# EAGLE design GAGAN_container_V1 (EAGLE 9.3.2)
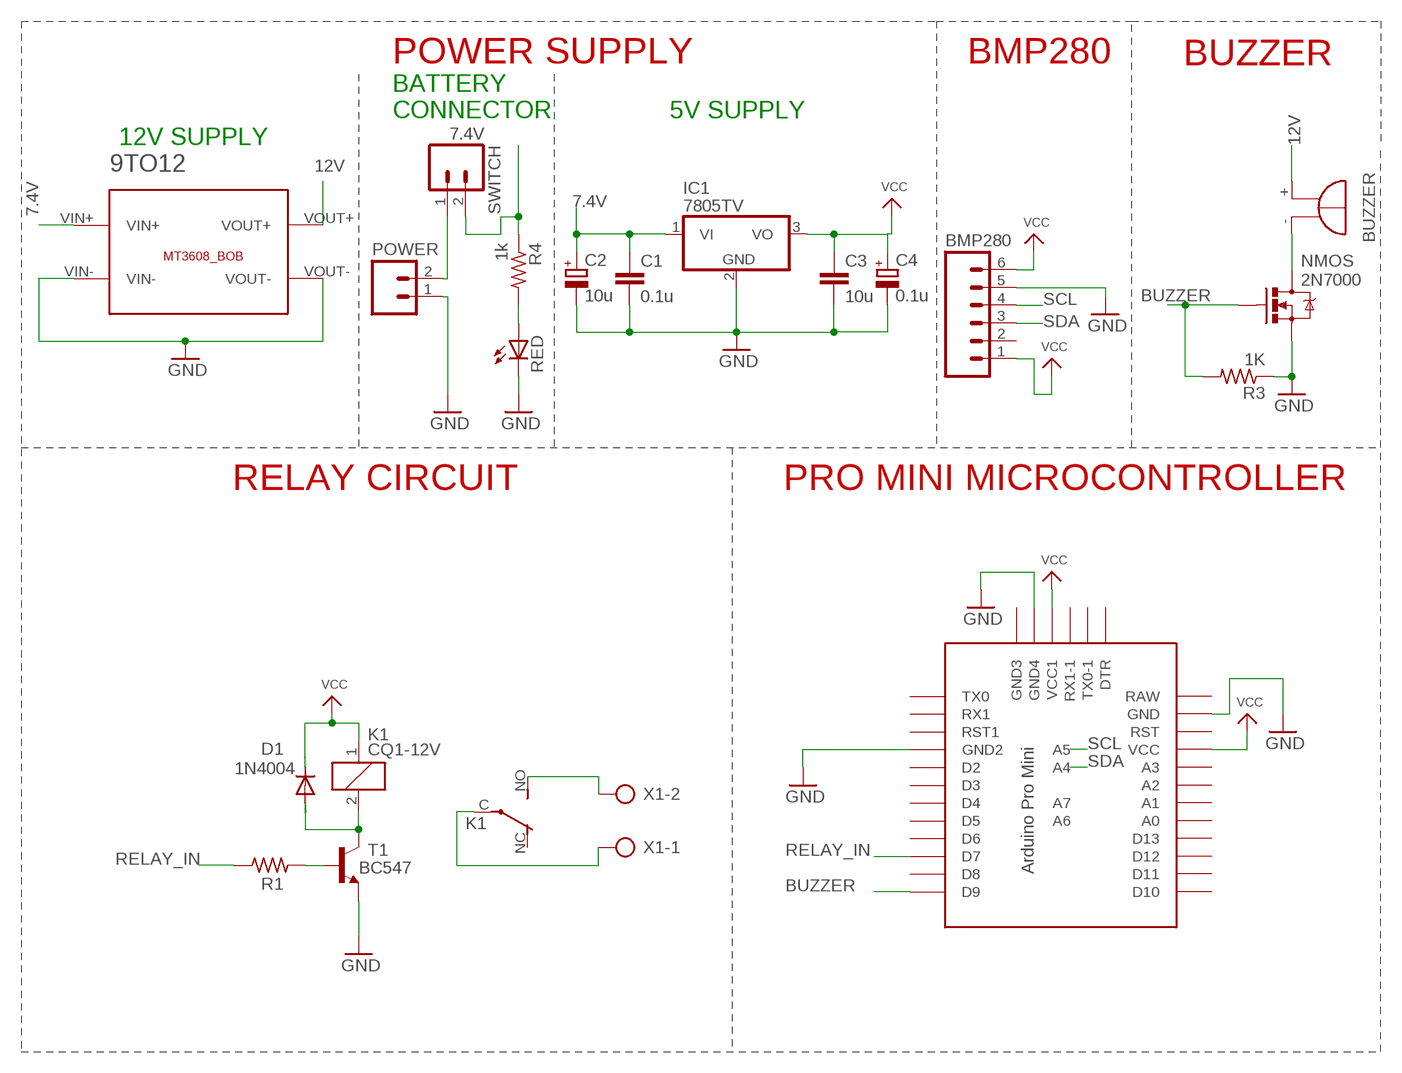
[diagram p0: schematic, sheet 1]

## Parts
9TO12  BREAKOUTS_MT3608_BOB  [BREAKOUTS_MT3608_BOB]
BMP280  M06  [06P]
C1  0.1u  C-EU025-025X050  [C025-025X050]
C2  10u  CPOL-EUE2.5-6  [E2,5-6]
C3  10u  C-EU025-025X050  [C025-025X050]
C4  0.1u  CPOL-EUE2.5-6  [E2,5-6]
D1  1N4004  [DO41-10]
IC1  7805TV  [TO220V]
K1  CQ1-12V  [CQ1]
POWER  CEDT_JANUARY_2015_V5_M02  [CEDT_JANUARY_2015_V5_02P]
Q1  SPARKFUN-DISCRETESEMI_MOSFET-NCHANNEL2N7000  [SPARKFUN-DISCRETESEMI_TO-92]
R1  R-US_0207/7  [0207/7]
R3  1K  R-US_0204/7  [0204/7]
R4  1k  R-US_0204/7  [0204/7]
RED  red  LED3MM  [LED3MM]
SG1  BUZZER_EB2209A  [BUZZER_EB2209A]
SWITCH  M02  [02P]
T1  BC547  [TO92]
U$1  PRO-MINI-2  [PRO-MINI-2]
X1  AK500/2-H  [AK500/2-H]

## Nets
7.4V [power]: 9TO12.VIN+ C1.1 C2.+ IC1.1(VI) R4.1 SWITCH.2
12V [power]: 9TO12.VOUT+ SG1.+
BUZZER: Q1.2(G) R3.2 U$1.D9
GND: 9TO12.VIN- 9TO12.VOUT- BMP280.5 C1.2 C2.- C3.2 C4.- IC1.2(GND) POWER.1 Q1.1(S) R3.1 RED.K(C) T1.1(E) U$1.GND U$1.GND1(GND2) U$1.GND3(GND4)
N$1 [power]: POWER.2 SWITCH.1
N$2: R4.2 RED.A
N$3 [power]: Q1.3(D) SG1.-
N$10: D1.A K1.2 T1.3(C)
N$11: R1.2 T1.2(B)
N$12: K1.C(2:P) X1.1
N$13: K1.NO(2:S) X1.2
RELAY_IN: R1.1 U$1.D7
SCL: BMP280.4 U$1.A5
SDA: BMP280.3 U$1.A4
VCC: BMP280.1 BMP280.6 C3.1 C4.+ D1.C IC1.3(VO) K1.1 U$1.VCC U$1.VCC1
Unconnected: BMP280.2 K1.NC(2:O) U$1.A0 U$1.A1 U$1.A2 U$1.A3 U$1.A6 U$1.A7 U$1.D2 U$1.D3 U$1.D4 U$1.D5 U$1.D6 U$1.D8 U$1.D10 U$1.D11 U$1.D12 U$1.D13 U$1.DTR U$1.GND2(GND3) U$1.RAW U$1.RST U$1.RST1 U$1.RX1 U$1.RX1-1 U$1.TX0 U$1.TX0-1

## Notes on the sheet
- POWER SUPPLY | BMP280 | BUZZER
- BATTERY
  CONNECTOR
- 5V SUPPLY
- 12V SUPPLY
- RELAY CIRCUIT | PRO MINI MICROCONTROLLER

## Library data of the parts
9TO12 = Cansat2019_3279_Container_v01:BREAKOUTS_MT3608_BOB
BMP280 = con-amp-quick:M06: AMP QUICK CONNECTOR; OC_FARNELL: unknown; OC_NEWARK: unknown
C1 C3 = resistor:C-EU: CAPACITOR, European symbol
C2 C4 = rcl:CPOL-EU: POLARIZED CAPACITOR, European symbol
D1 = diode:1N4004: DIODE general purpose rectifier, 1 A
IC1 = linear:78*: Positive VOLTAGE REGULATOR Source: http://cache.national.com/ds/LM/LM78L05.pdf http://www.fairchildsemi.com/ds/LM/LM7805.pdf
K1 = relay:CQ1-12V: AUTOMOTIVE QUIET RELAY NAiS Source: http://www.mew-europe.com/.. en_ds_61208_0000.pdf; OC_FARNELL: unknown; OC_NEWARK: unknown
POWER = Cansat2019_3279_Container_v01:CEDT_JANUARY_2015_V5_M02: AMP QUICK CONNECTOR
Q1 = Cansat2019_3279_Container_v01:SPARKFUN-DISCRETESEMI_MOSFET-NCHANNEL: Common NMOSFET Parts MFG P/N Store ID Prod ID FDD8780 TRANS-09984 SI7820DN TRANS-11055 FDS6630A IC-08089 2N7002PW TRANS-11151 FQP30N06L COM-10213 TRANS-10060 BSS123LT1G TRANS-08345 BSS138 TRANS-00830 BS170 2N7000
R1 R3 R4 = rcl:R-US_: RESISTOR, American symbol
RED = CEDT_JANUARY_2015_v5:LED
SG1 = Cansat2019_3279_Container_v01:BUZZER_EB2209A: BUZZER Source: Buerklin; OC_FARNELL: unknown; OC_NEWARK: unknown
SWITCH = CEDT_JANUARY_2015_v5:M02: AMP QUICK CONNECTOR
T1 = transistor:BC547: NPN TRANSISTOR
U$1 = Arduino-clone:PRO-MINI-2: Arduino Pro Mini Layout 2 Sparkfun.com
X1 = con-ptr500:AK500/2-H: CONNECTOR Aug. 2004 / PTR Meßtechnik: Die Bezeichnung der Serie AK505 wurde geändert. Es handelt sich hierbei um AK500 in horizontaler Ausführung.; OC_FARNELL: unknown; OC_NEWARK: unknown

## Net classes
0 default: width 0.61 mm
1 power: width 0.61 mm

## Board
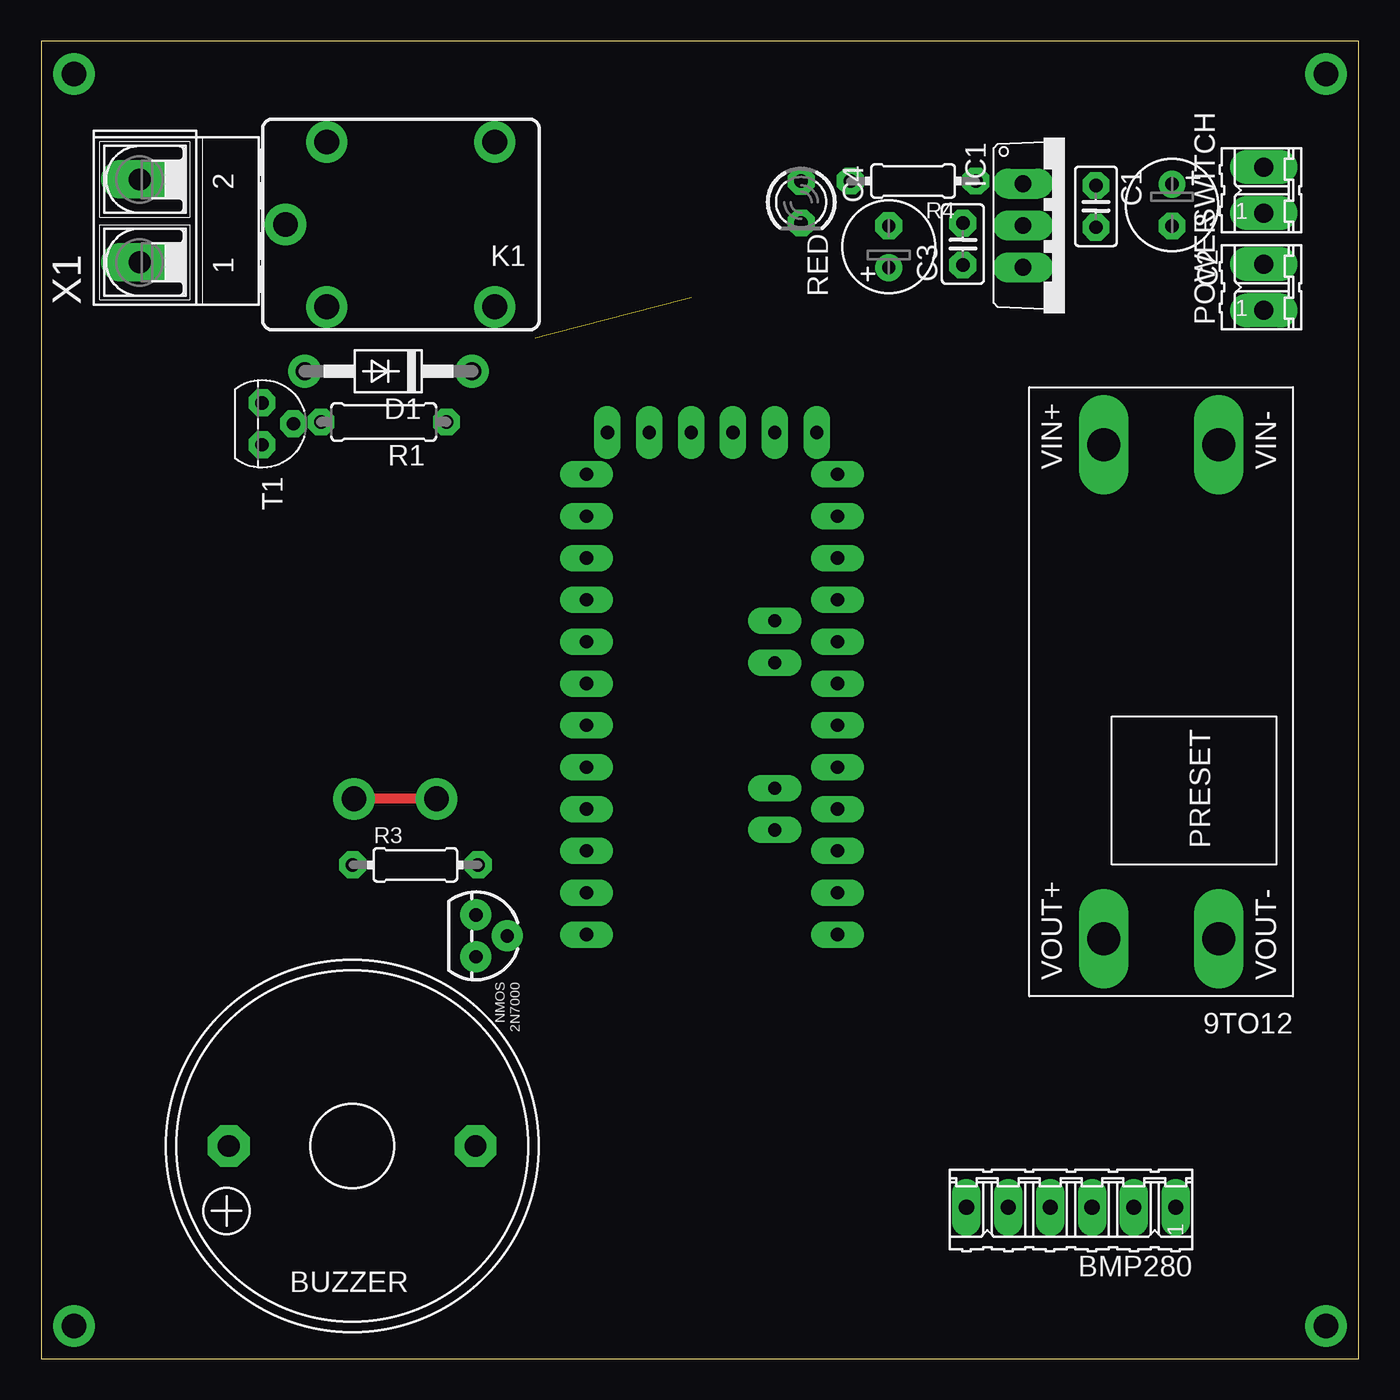
[diagram p1: board, top side]
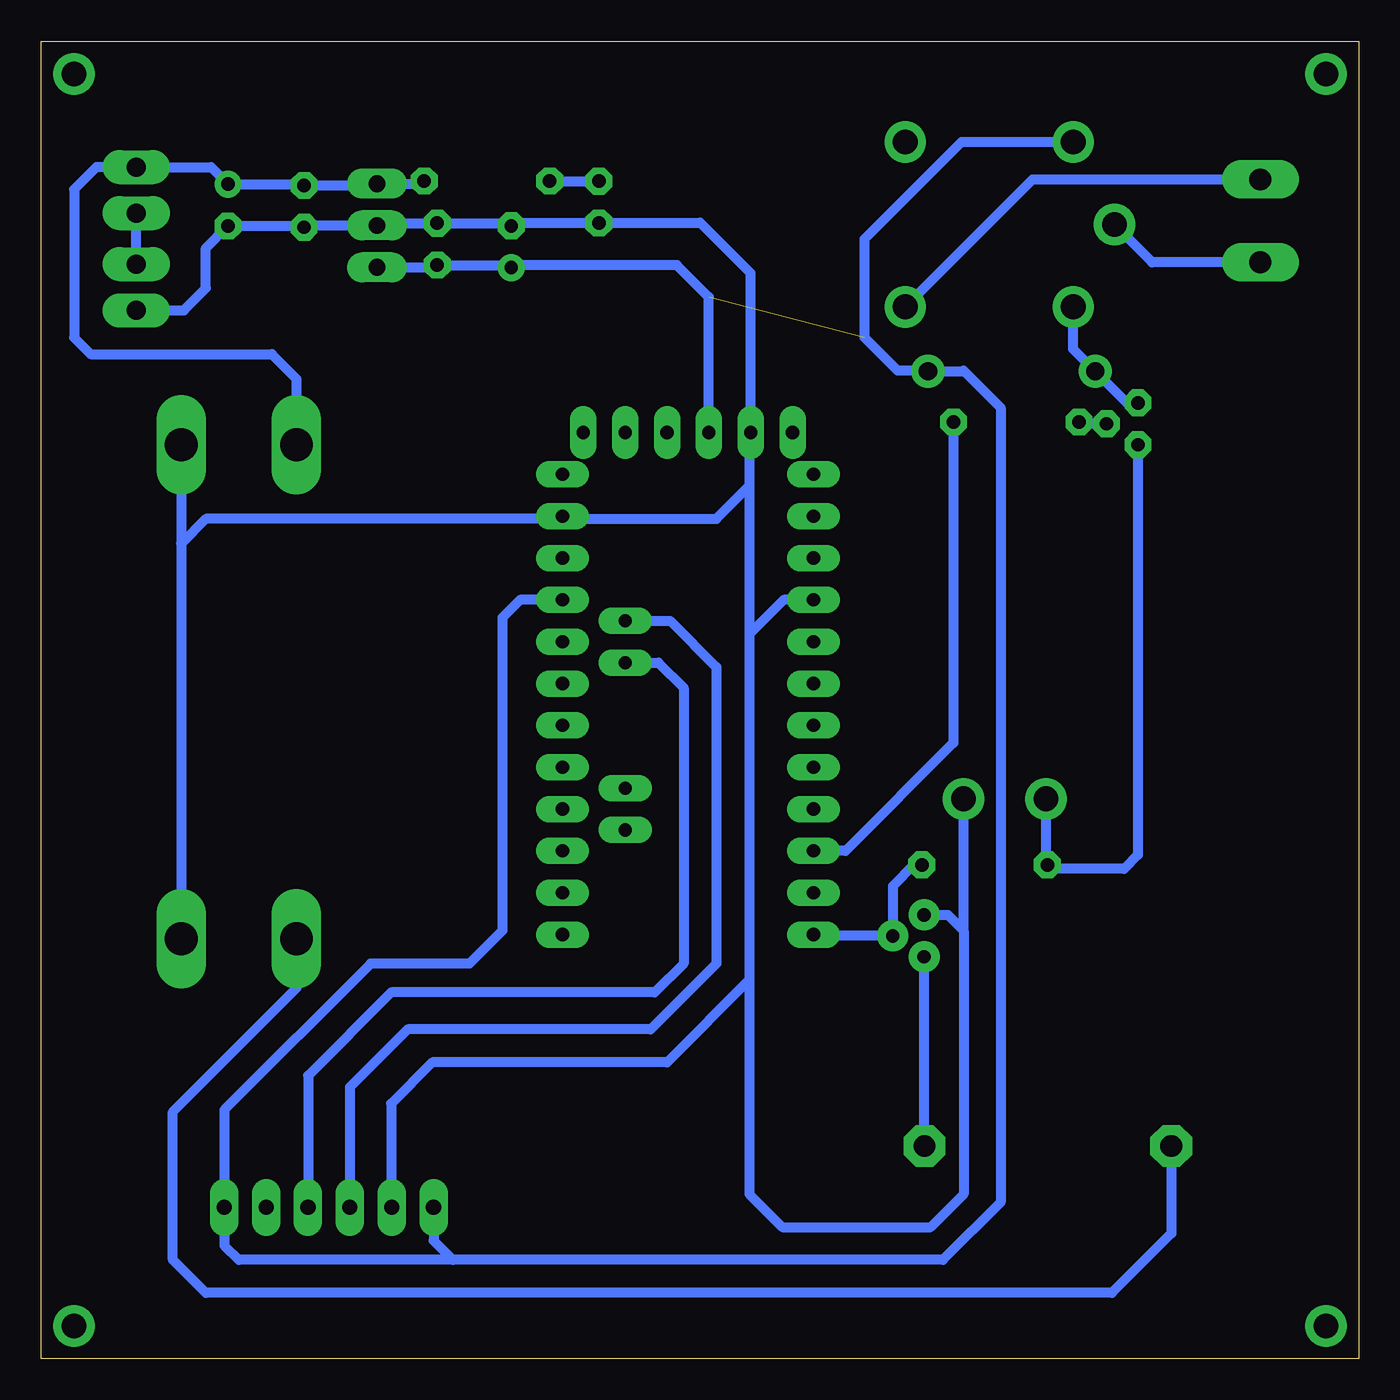
[diagram p2: board, bottom side, seen from below]

Size 80 x 80 mm. Coordinates in mm from the lower left corner, seen from the top.
Outline: 0,0 80,0 80,80 0,80 0,0
Copper layers (1*16): Top 0.035mm / dielectric 1.5mm / Bottom 0.035mm
Design rules "default *": minimum track width 6mil, minimum drill 0.35mm, track to track 16mil, track to pad 16mil, pad to pad 16mil, via to via 16mil, smd to smd 16mil, copper to edge 40mil, drill to drill 6mil, minimum pad ring 16mil, minimum via ring 16mil, stop-mask expansion 4mil, vias tented up to drill 0mil, thermal gap 10mil

### Footprints (pad centres in the part's own frame; a part is rotated, then mirrored left to right if it is on the bottom)
BREAKOUTS_MT3608_BOB = drill 2 pad 3 long: VIN+ 33.5,-4.5; VIN- 33.5,-11.5; VOUT+ 3.5,-4.5; VOUT- 3.5,-11.5
06P = drill 0.914 long: 1 -6.35,0; 2 -3.81,0; 3 -1.27,0; 4 1.27,0; 5 3.81,0; 6 6.35,0
C025-025X050 = drill 0.813 octagon: 1 -1.27,0; 2 1.27,0
E2,5-6 = drill 0.813 pad 1.6: + -1.27,0 | drill 0.813 pad 1.6 octagon: - 1.27,0
DO41-10 = drill 1.118: A 5.08,0; C -5.08,0
TO220V = drill 1.016 long: 1 -2.54,-2.54; 2 0,-2.54; 3 2.54,-2.54
CQ1 = drill 1.5: 1 4.5,-5; 2 4.5,5; C 7,0; NC -5.7,-5; NO -5.7,5
CEDT_JANUARY_2015_V5_02P = drill 1.143 long: 1 -1.397,0; 2 1.397,0
SPARKFUN-DISCRETESEMI_TO-92 = drill 0.813 pad 1.88: 1 -1.27,0; 2 0,1.905; 3 1.27,0
0207/7 = drill 0.813 octagon: 1 -3.81,0; 2 3.81,0
0204/7 = drill 0.813 octagon: 1 -3.81,0; 2 3.81,0
LED3MM = drill 0.813 octagon: A -1.27,0; K 1.27,0
BUZZER_EB2209A = drill 1.321 pad 2.54 octagon: + 7.493,0; - -7.493,0
02P = drill 1.143 long: 1 -1.397,0; 2 1.397,0
TO92 = drill 0.813 octagon: 1 1.27,0; 2 0,1.905; 3 -1.27,0
PRO-MINI-2 = drill 0.8 long: A0 6.35,2.54; A1 6.35,0; A2 6.35,-2.54; A3 6.35,-5.08; A4 2.54,1.27; A5 2.54,3.81; A6 2.54,-8.89; A7 2.54,-6.35; D2 -8.89,2.54; D3 -8.89,0; D4 -8.89,-2.54; D5 -8.89,-5.08; D6 -8.89,-7.62; D7 -8.89,-10.16; D8 -8.89,-12.7; D9 -8.89,-15.24; D10 6.35,-15.24; D11 6.35,-12.7; D12 6.35,-10.16; D13 6.35,-7.62; DTR 5.08,15.24; GND 6.35,10.16; GND1 -8.89,5.08; GND2 -7.62,15.24; GND3 -5.08,15.24; RAW 6.35,12.7; RST 6.35,7.62; RST1 -8.89,7.62; RX1 -8.89,10.16; RX1-1 0,15.24; TX0 -8.89,12.7; TX0-1 2.54,15.24; VCC 6.35,5.08; VCC1 -2.54,15.24
AK500/2-H = drill 1.321 long: 1 -2.515,0; 2 2.515,0

### Placement (x,y rotation side)
9TO12  60,22 90 top
BMP280  62.53,9.2 180 top
C1  64.04,69.97 270 top
C2  68.66,70.05 270 top
C3  55.96,67.68 90 top
C4  51.46,67.52 90 top
D1  21.08,59.96 180 top
IC1  62.15,68.81 270 top
K1  21.84,68.87 180 top
POWER  74.23,65.06 90 top
Q1  26.39,25.68 270 top
R1  20.8,56.88 180 top
R3  22.72,29.99 0 top
R4  52.94,71.51 180 top
RED  46.14,70.23 270 top
SG1  18.88,12.92 180 top
SWITCH  74.23,70.95 90 top
T1  13.41,56.77 270 top
U$1  42,41 0 top
X1  5.98,69.09 90 top

### Tracks (layer width: path | path; a pad name or v marks a point on that pad's centre or on a via)
7.4V
  Bottom 0.61: R4.1 56.91,71.35 IC1.1 59.72,71.24 C1.1 64.12,71.32 C2.+ 69.69,72.35 SWITCH.2 76.65,72.35 78,71 78,62 77,61 66,61 64.5,59.5 9TO12.VIN+
12V
  Bottom 0.61: SG1.+ 11.39,7.61 15,4 70,4 72,6 72,15 64.5,22.5 9TO12.VOUT+
BUZZER
  Bottom 0.61: U$1.D9 33.03,25.68 Q1.2 28.3,28.7 27.01,29.99 R3.2
GND  (via drill 1.5)
  Top 0.61: v24,34 v19,34
  Bottom 0.61: POWER.1 71.34,63.66 70,65 70,67.44 C2.- 64.12,68.78 C1.2 63.93,68.81 IC1.2 59.47,68.95 C3.2 51.62,68.95 C4.- 51.29,68.96 RED.K 40.04,68.96 40,69 36.92,65.92 U$1.GND3 37,56.16 37,53 | T1.1 13.41,30.59 14.25,29.75 18.67,29.75 R3.1 19,30.08 v19,34 | 9TO12.VIN- 71.5,49.5 | 71.5,49.5 9TO12.VOUT- | U$1.GND1 34.92,46.08 37,44 | BMP280.5 58.75,9.23 58.75,15.5 56.25,18 42,18 37,23 | 37,44 37,23 | 71.5,49.5 70,51 48.51,51 U$1.GND 48.19,51 39,51 37,53 | 37,53 37,44 | Q1.1 24.95,26.95 24,26 | 24,26 24,10 26,8 35,8 37,10 37,23 | 24,26 v24,34
N$1
  Bottom 0.61: POWER.2 SWITCH.1
N$2
  Bottom 0.61: R4.2 RED.A
N$3
  Bottom 0.61: SG1.- 26.37,24.39 Q1.3
N$4  (via drill 1.5)
  other vias: 78,78
N$5  (via drill 1.5)
  other vias: 78,2
N$6  (via drill 1.5)
  other vias: 2,2
N$7  (via drill 1.5)
  other vias: 2,78
N$10
  Bottom 0.61: K1.2 17.34,61.3 16.02,59.98 D1.A 14.08,58.04 T1.3
N$11
  Bottom 0.61: T1.2 16.88,56.77 R1.2
N$12
  Bottom 0.61: X1.1 12.54,66.58 K1.C
N$13
  Bottom 0.61: K1.NO 19.8,71.61 X1.2
RELAY_IN
  Bottom 0.61: R1.1 24.61,37.39 31.16,30.84 U$1.D7
SCL
  Bottom 0.61: BMP280.4 61.26,16.49 57.75,20 43,20 39,24 39,42 41.81,44.81 U$1.A5
SDA
  Bottom 0.61: U$1.A4 42.52,42.27 41,40.75 41,24 42.75,22.25 58.75,22.25 63.8,17.2 BMP280.3
VCC  (1 unrouted)
  Bottom 0.61: IC1.3 56.1,66.27 C3.1 51.62,66.41 | 51.62,66.41 C4.+ | U$1.VCC1 39.46,64.46 41.41,66.41 51.62,66.41 | 55,6 25.25,6 21.75,9.5 21.75,57.75 24,60 24.04,59.96 D1.C 26.2,60 28,60 30,62 30,68 24.13,73.87 K1.1 | 55,6 68,6 68.88,6.88 BMP280.1 68.88,15.12 60,24 54,24 52,26 52,45 50.92,46.08 U$1.VCC | BMP280.6 56.18,7.18 55,6